# Altium schematic sheet 4CH RX.SchDoc
size A3
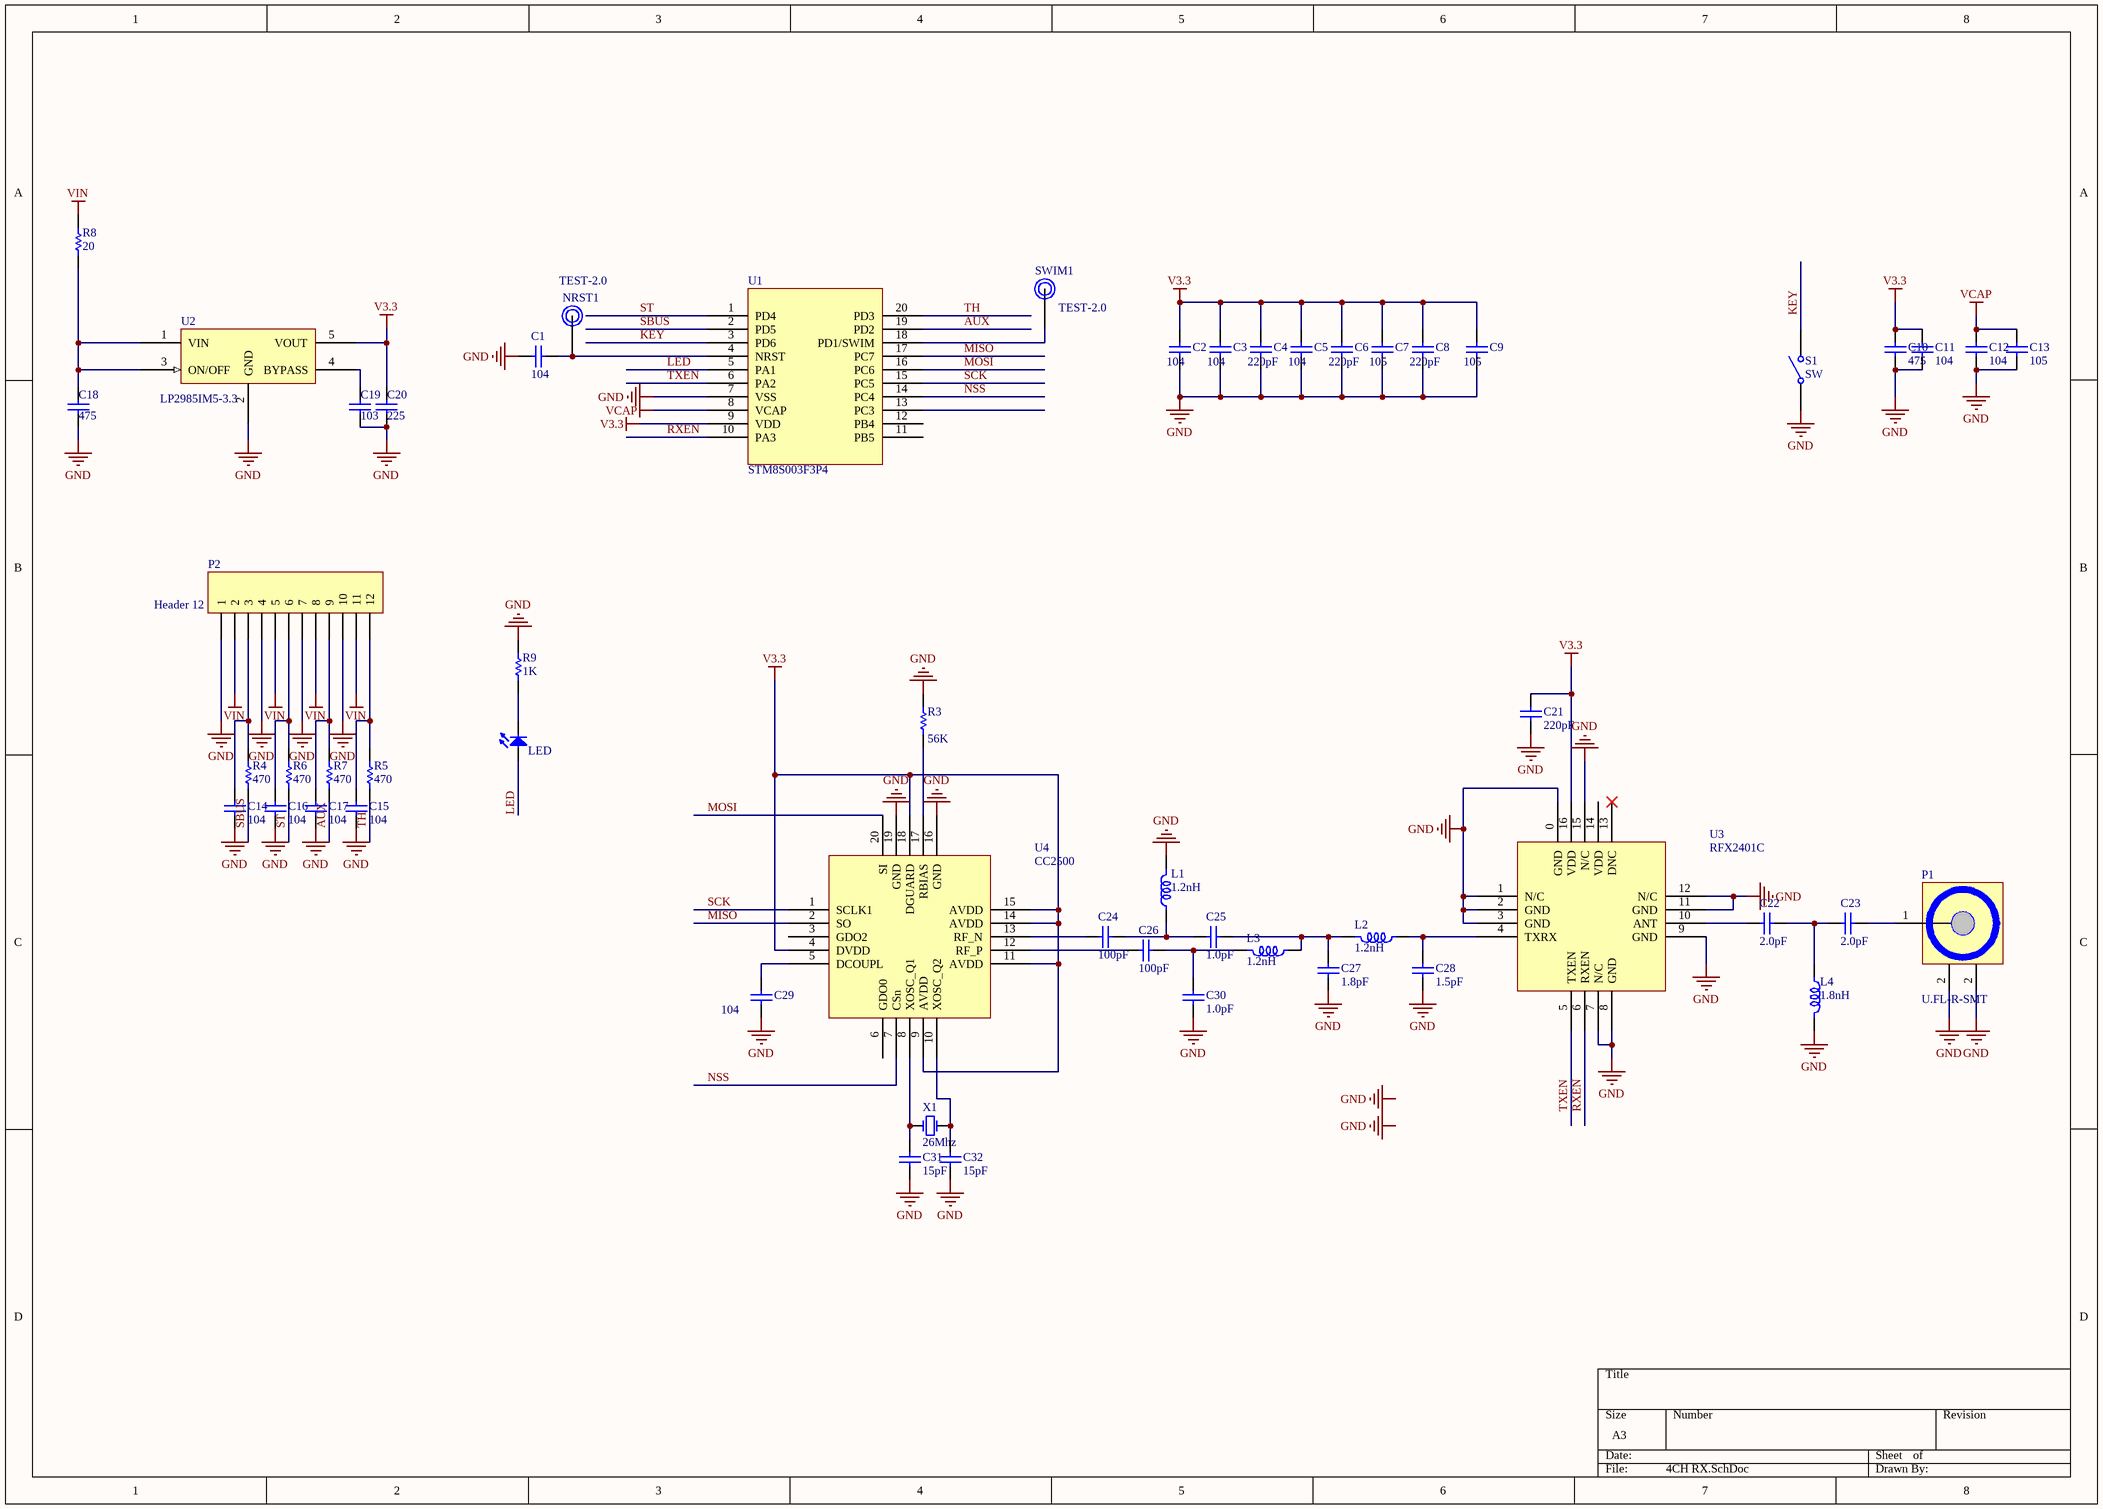
[diagram p0: 4CH RX.SchDoc]

## Parts
?  LED  [LED0402]
C1  104  [C0402]
C2  104  [C0402]
C3  104  [C0402]
C4  220pF  [C0402]
C5  104  [C0402]
C6  220pF  [C0402]
C7  105  [C0603]
C8  220pF  [C0402]
C9  105  [C0603]
C10  475  [C0402]
C11  104  [C0402]
C12  104  [C0402]
C13  105  [C0402]
C14  104  [C0402]
C15  104  [C0402]
C16  104  [C0402]
C17  104  [C0402]
C18  475  [C0603]
C19  103  [C0402]
C20  225  [C0603]
C21  220pF  [C0402]
C22  2.0pF  [C0402]
C23  2.0pF  [C0402]
C24  100pF  [C0402]
C25  1.0pF  [C0402]
C26  100pF  [C0402]
C27  1.8pF  [C0402]
C28  1.5pF  [C0402]
C29  104  [C0402]
C30  1.0pF  [C0402]
C31  15pF  [C0402]
C32  15pF  [C0402]
L1  1.2nH  [LL0402]
L2  1.2nH  [LL0402]
L3  1.2nH  [LL0402]
L4  1.8nH  [LL0402]
NRST1  TEST-2.0  [TEST-2.0]
P1  U.FL-R-SMT  [U.FL-R-SMT(60)]
P2  Header 12  [CON3x4-XH]
R3  56K  [R0402]
R4  470  [R0402]
R5  470  [R0402]
R6  470  [R0402]
R7  470  [R0402]
R8  20  [R0805]
R9  1K  [R0402]
S1  SW  [KAY3X4]
SWIM1  TEST-2.0  [TEST-2.0]
U1  STM8S003F3P4  [TSOP65P640-20AL]
U2  LP2985IM5-3.3  [SOT235]
U3  RFX2401C  [QFN16]
U4  CC2500  [QFN20]
X1  26Mhz  [CRYSTAL-3225]

## Nets
GND: C1.2 C2.1 C3.1 C4.1 C5.1 C6.1 C7.1 C8.1 C9.1 C10.1 C11.1 C12.1 C13.1 C14.1 C15.1 C16.1 C17.1 C18.1 C19.1 C20.1 C21.1 C27.1 C28.1 C29.1 C30.2 C31.1 C32.1 L1.2 L4.2 P1.2(GND) P2.1 P2.4 P2.7 P2.10 R3.2 R9.2 S1.1(COMMON) U1.7(VSS) U2.2(GND) U3.0(GND) U3.1(N/C) U3.2(GND) U3.3(GND) U3.7(N/C) U3.8(GND) U3.9(GND) U3.11(GND) U3.12(N/C) U3.15(N/C) U4.16(GND) U4.19(GND)
V3.3: C2.2 C3.2 C4.2 C5.2 C6.2 C7.2 C8.2 C9.2 C10.2 C11.2 C20.2 C21.2 U1.9(VDD) U2.5(VOUT) U3.16(VDD) U4.4(DVDD) U4.9(AVDD) U4.11(AVDD) U4.14(AVDD) U4.15(AVDD) U4.18(DGUARD)
VCAP: C12.2 C13.2 U1.8(VCAP)
VIN: P2.2 P2.5 P2.8 P2.11 R8.2
AUX: R7.1 U1.19(PD2)
KEY: S1.2(NO) U1.3(PD6)
LED: ?.1(A) U1.5(PA1)
MISO: U1.17(PC7) U4.2(SO)
MOSI: U1.16(PC6) U4.20(SI)
NSS: U1.14(PC4) U4.7(CSn)
RXEN: U1.10(PA3) U3.6(RXEN)
SBUS: R4.1 U1.2(PD5)
SCK: U1.15(PC5) U4.1(SCLK1)
ST: R6.1 U1.1(PD4)
TH: R5.1 U1.20(PD3)
TXEN: U1.6(PA2) U3.5(TXEN)
Net?_2: ?.2(K) R9.1
NetC1_1: C1.1 NRST1.1 U1.4(NRST)
NetC14_2: C14.2 P2.3 R4.2
NetC15_2: C15.2 P2.12 R5.2
NetC16_2: C16.2 P2.6 R6.2
NetC17_2: C17.2 P2.9 R7.2
NetC18_2: C18.2 R8.1 U2.1(VIN) U2.3(ON/OFF)
NetC19_2: C19.2 U2.4(BYPASS)
NetC22_1: C22.1 C23.1 L4.1
NetC22_2: C22.2 U3.10(ANT)
NetC23_2: C23.2 P1.1(RF)
NetC24_1: C24.1 C25.2 L1.1
NetC24_2: C24.2 U4.13(RF_N)
NetC25_1: C25.1 C27.2 L2.2 L3.1
NetC26_1: C26.1 C30.1 L3.2
NetC26_2: C26.2 U4.12(RF_P)
NetC28_2: C28.2 L2.1 U3.4(TXRX)
NetC29_2: C29.2 U4.5(DCOUPL)
NetC31_2: C31.2 U4.8(XOSC_Q1) X1.1(OSC1)
NetC32_2: C32.2 U4.10(XOSC_Q2) X1.3(OSC2)
NetR3_1: R3.1 U4.17(RBIAS)
NetSWIM1_1: SWIM1.1 U1.18(PD1/SWIM)

Not connected (* = marked no-connect by the designer): U1 11(PB5) 12(PB4) 13(PC3); U3 13(DNC)* 14(VDD); U4 3(GDO2) 6(GDO0); X1 2(GROUND) 4(VDD)

## Notes on the sheet
- Labels drawn without touching a wire or pin: GND

## Library data of the parts
? = LED1: 贴片LED; Published: 8-Jun-2000; LatestRevisionDate: 08-Jul-2005; LatestRevisionNote: Mech Layer 1 removed.; PackageReference: LED-1; Publisher: Altium Limited
C1 C10-C20 = Cap1: 贴片瓷介电容; Published: 8-Jun-2000; LatestRevisionDate: 17-Jul-2002; LatestRevisionNote: Re-released for DXP Platform.; PackageReference: RAD-0.3; Publisher: Altium Limited
C2-C9 C29 = Cap1: 100nF 10% 0402 X5R  Murata GRM15 series; Published: 8-Jun-2000; LatestRevisionDate: 17-Jul-2002; LatestRevisionNote: Re-released for DXP Platform.; PackageReference: RAD-0.3; Publisher: Altium Limited
C21-C23 C25 C27 C28 C30 = Cap1: +-0.25pF 0402 NP0 Murata GRM15; Published: 8-Jun-2000; LatestRevisionDate: 17-Jul-2002; LatestRevisionNote: Re-released for DXP Platform.; PackageReference: RAD-0.3; Publisher: Altium Limited
C24 C26 = Cap1: 100pF 5% 0402 NP0; Published: 8-Jun-2000; LatestRevisionDate: 17-Jul-2002; LatestRevisionNote: Re-released for DXP Platform.; PackageReference: RAD-0.3; Publisher: Altium Limited
C31 C32 = Cap1: 27pF 5% NP0; Published: 8-Jun-2000; LatestRevisionDate: 17-Jul-2002; LatestRevisionNote: Re-released for DXP Platform.; PackageReference: RAD-0.3; Publisher: Altium Limited
L1-L4 = Inductor: +-0.3nH 0402 monilithic Murata LQG15HS
P1 = U.FL-R-SMT: 贴片小型高频同轴接插器
P2 = Header 12: Header, 12-Pin; LatestRevisionDate: 17-Jul-2002; LatestRevisionNote: Re-released for DXP Platform.; Publisher: Altium Limited
R3 = Res1: 56K 1%; Published: 8-Jun-2000; LatestRevisionDate: 17-Jul-2002; LatestRevisionNote: Re-released for DXP Platform.; PackageReference: AXIAL-0.3; Publisher: Altium Limited; Value: 56K
R4-R8 = Res1: 贴片厚膜电阻; Value: 1K; Published: 8-Jun-2000; LatestRevisionDate: 17-Jul-2002; LatestRevisionNote: Re-released for DXP Platform.; PackageReference: AXIAL-0.3; Publisher: Altium Limited
R9 = Res1: 贴片厚膜电阻; Published: 8-Jun-2000; LatestRevisionDate: 17-Jul-2002; LatestRevisionNote: Re-released for DXP Platform.; PackageReference: AXIAL-0.3; Publisher: Altium Limited; Value: 1K
S1 = SW-SPST: Single-Pole, Single-Throw Switch; Published: 24-Mar-1999; LatestRevisionDate: 17-Jul-2002; LatestRevisionNote: Re-released for DXP Platform.; PackageReference: SPST-2; Publisher: Altium Limited; PackageDescription: Switch; 2 Leads
X1 = XTAL 3: epcos NDK